# Altium schematic sheet hiside.SchDoc
size A4
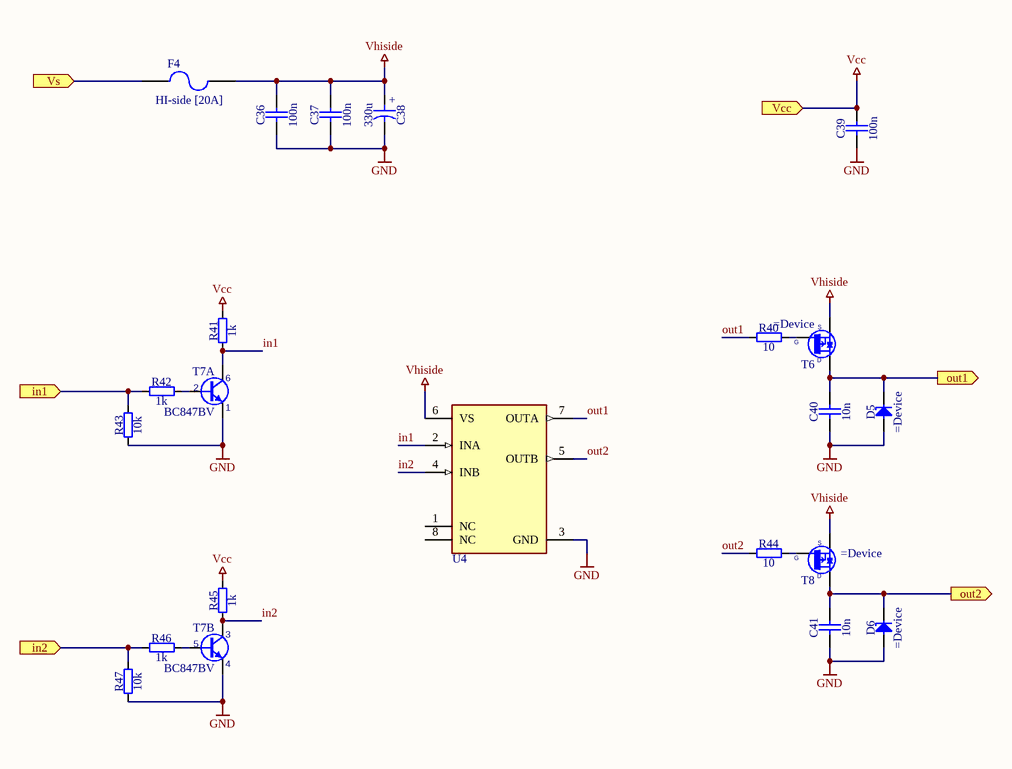
[diagram p0: hiside.SchDoc]

## Parts
C36  100n  [CAP 1206/3216 - 0.8MM]
C37  100n  [CAP 1206/3216 - 0.8MM]
C38  330u  [CAP AL TH D10 L5 H12.5]
C39  100n  [CAPC1608X87N]
C40  10n  [CAPC1608X87N]
C41  10n  [CAPC1608X87N]
D5  (no value)  [DIOM7659X265N]
D6  (no value)  [DIOM7659X265N]
F4  HI-side [20A]  [automotive fuse by sd]
R40  10  [RESC2012X60N]
R41  1k  [RESC1608X55N]
R42  1k  [RESC1608X55N]
R43  10k  [RESC1608X55N]
R44  10  [RESC2012X60N]
R45  1k  [RESC1608X55N]
R46  1k  [RESC1608X55N]
R47  10k  [RESC1608X55N]
T6  (no value)  [TO228P991X239-3N-R546X521]
T7  BC847BV  [SOT65P210X110-6N]  (parts A,B of 2)
T8  (no value)  [TO228P991X239-3N-R546X521]
U4  IR4427STRPBF  [SOIC127P600X175-8N]  (value not drawn)

## Ports
in1 (in), in2 (in), out1 (out), out2 (out), Vcc (in), Vs (in)

## Nets
GND: C36.1 C37.1 C38.2 C39.1 C40.1 C41.1 D5.2(A) D6.2(A) R43.1 R47.1 T7.1(E) T7.4(E) U4.3(GND)
Vcc: C39.2 R41.2 R45.2 ; port Vcc
Vhiside: C36.2 C37.2 C38.1 F4.2 T6.3(S) T8.3(S) U4.6(VS)
in1: R41.1 T7.6(C) U4.2(INA)
in1: R42.1 R43.2 ; port in1  [a separate net that carries the same name]
in2: R45.1 T7.3(C) U4.4(INB)
in2: R46.1 R47.2 ; port in2  [a separate net that carries the same name]
out1: C40.2 D5.1(C) T6.1(D) ; port out1
out1: R40.1 U4.7(OUTA)  [a separate net that carries the same name]
out2: C41.2 D6.1(C) T8.1(D) ; port out2
out2: R44.1 U4.5(OUTB)  [a separate net that carries the same name]
Vs: F4.1 ; port Vs
NetR40_2: R40.2 T6.2(G)
NetR42_2: R42.2 T7.2(B)
NetR44_2: R44.2 T8.2(G)
NetR46_2: R46.2 T7.5(B)

Not connected (* = marked no-connect by the designer): U4 1(NC) 8(NC)

## Notes on the sheet
- (in symbol Capacitor - polarized) +

## Library data of the parts
C36 C37 C39-C41 = Capacitor - non polarized: Non-polarised capacitor
  C36 C37 C39: Value: 100n
  C40 C41: Value: 10n
C38 = Capacitor - polarized: Polarised capacitor; Value: 330u
D5 D6 = Diode ESD: ESD protection diode
F4 = Fuse 2: Fuse; Published: 8-Jun-2000; LatestRevisionDate: 17-Jul-2002; LatestRevisionNote: Re-released for DXP Platform.; PackageReference: PIN-W2/E2.8; Publisher: Altium Limited; PackageDescription: Thru-Hole; 2 Leads
R40-R47 = Resistor
  R40 R44: Value: 10
  R41 R42 R45 R46: Value: 1k
  R43 R47: Value: 10k
T6 T8 = P-MOSFET-D 1D 2G 3S: P-CHANNEL MOSFET WITH DIODE
T7 = BC847BV: 45V, 100mA NPN General Purpose Double Transistor; Device: BC847BV